# EAGLE design SA_Shield (EAGLE 9.6.2)
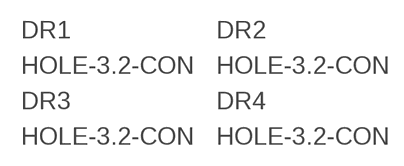
[diagram p0: schematic, sheet 1]

## Parts
DR1  HOLE-3.2-CON  [HOLE_3.2_CON]
DR2  HOLE-3.2-CON  [HOLE_3.2_CON]
DR3  HOLE-3.2-CON  [HOLE_3.2_CON]
DR4  HOLE-3.2-CON  [HOLE_3.2_CON]

## Library data of the parts
DR1-DR4 = my_connector:HOLE-3.2

## Board
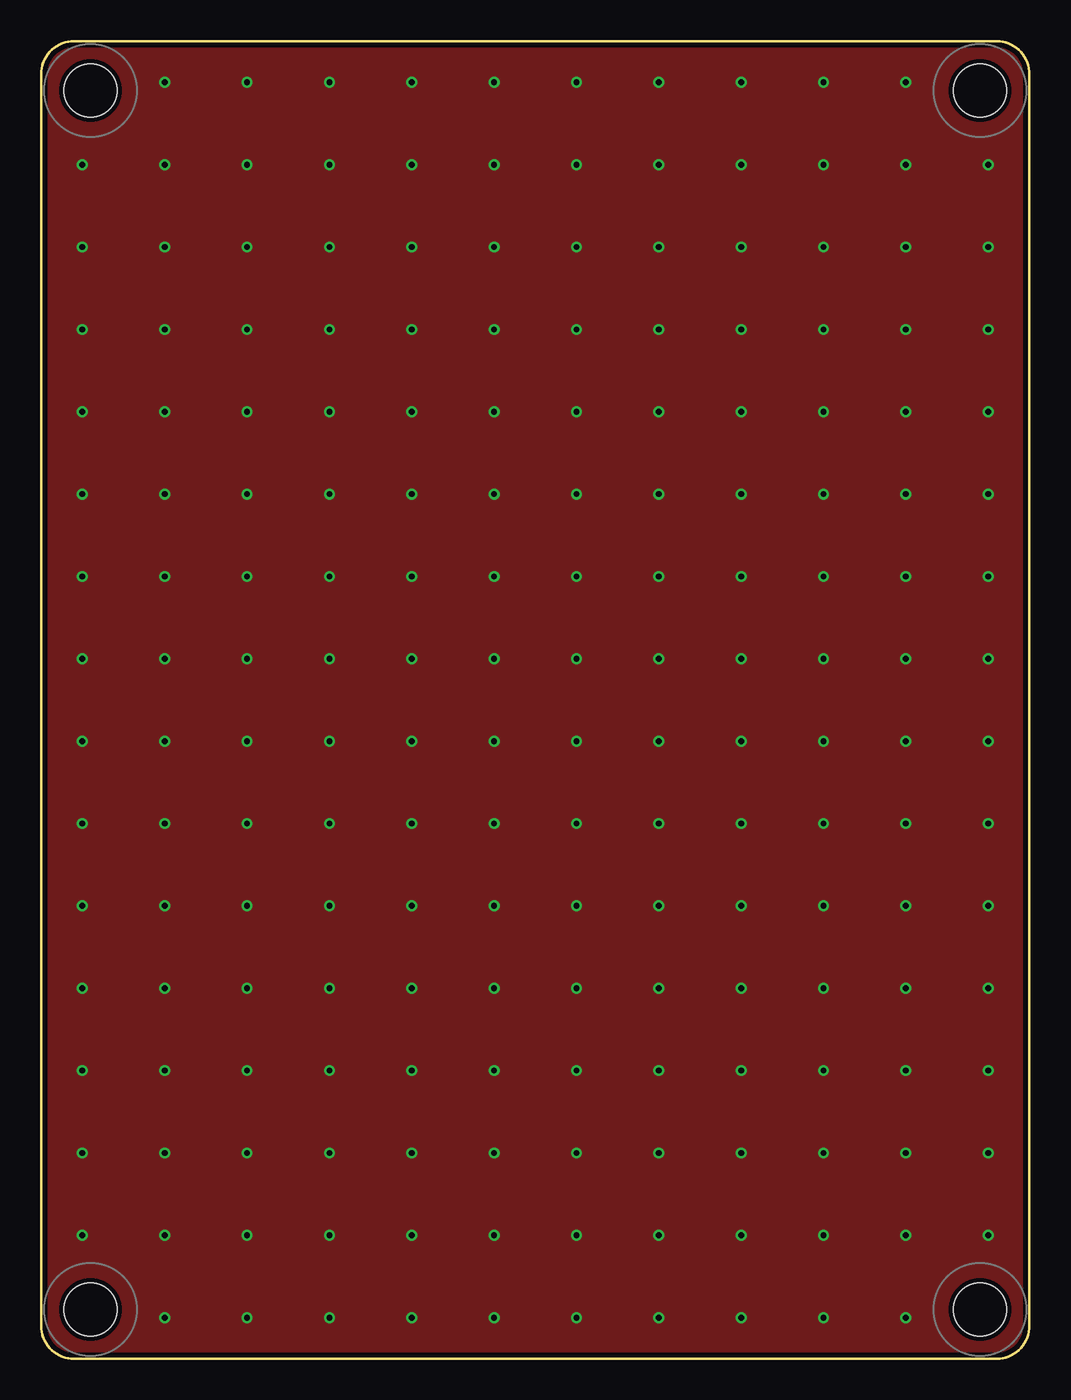
[diagram p1: board, top side]
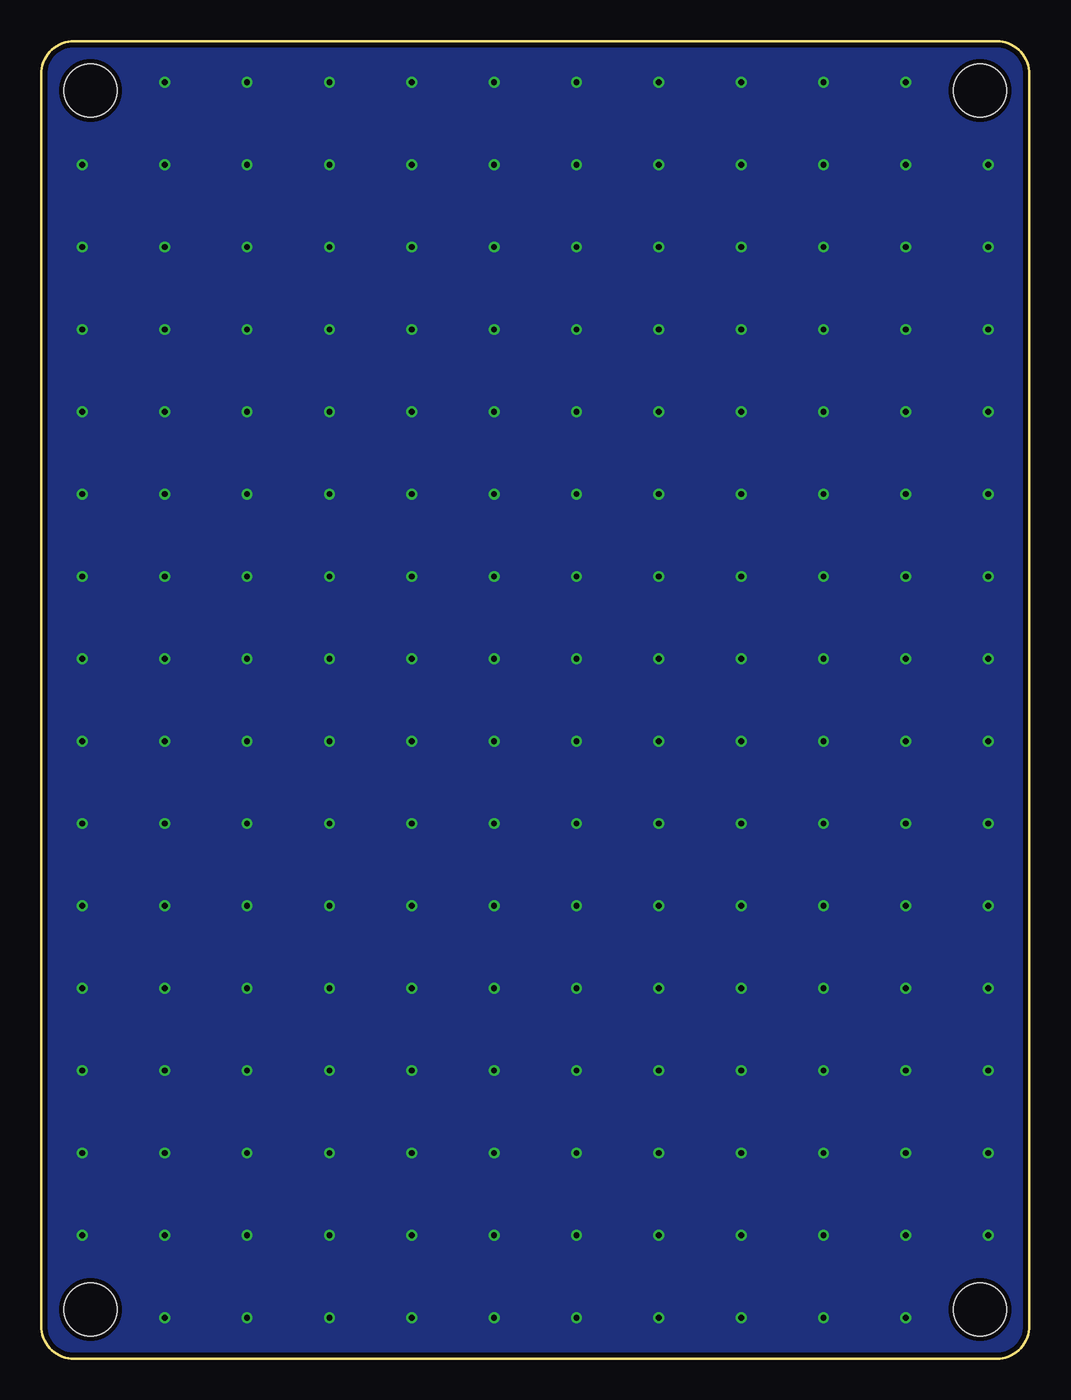
[diagram p2: board, bottom side, seen from below]

Size 60 x 80 mm. Coordinates in mm from the lower left corner, seen from the top.
Outline: 2,0 58,0 arc90 60,2 60,78 arc90 58,80 2,80 arc90 0,78 0,2 arc90 2,0
Copper layers (1*16): Top 0.035mm / dielectric 1.5mm / Bottom 0.035mm
Design rules "SeeedStudio_2layer_DRU_20140221": minimum track width 6mil, minimum drill 0.3mm, track to track 8mil, track to pad 8mil, pad to pad 8mil, via to via 12mil, smd to smd 0mil, copper to edge 0.3mm, drill to drill 10mil, minimum pad ring 0.15mm, minimum via ring 6mil, stop-mask expansion 2mil, vias tented up to drill 1mm, thermal gap 10mil

### Footprints (pad centres in the part's own frame; a part is rotated, then mirrored left to right if it is on the bottom)
HOLE_3.2_CON = hole 3.2: 0,0

### Placement (x,y rotation side)
DR1  3,3 0 top
DR2  3,77 0 top
DR3  57,3 0 top
DR4  57,77 0 top

### Tracks (layer width: path | path; a pad name or v marks a point on that pad's centre or on a via)
GND  (via drill 0.35)
  other vias: 7.5,2.5 12.5,2.5 17.5,2.5 22.5,2.5 27.5,2.5 32.5,2.5 37.5,2.5 42.5,2.5 47.5,2.5 2.5,7.5 7.5,7.5 12.5,7.5 17.5,7.5 22.5,7.5 27.5,7.5 32.5,7.5 37.5,7.5 42.5,7.5 47.5,7.5 52.5,7.5 57.5,7.5 52.5,2.5 2.5,12.5 7.5,12.5 12.5,12.5 17.5,12.5 22.5,12.5 27.5,12.5 32.5,12.5 37.5,12.5 42.5,12.5 47.5,12.5 52.5,12.5 57.5,12.5 2.5,27.5 7.5,27.5 12.5,27.5 17.5,27.5 22.5,27.5 27.5,27.5 32.5,27.5 37.5,27.5 42.5,27.5 47.5,27.5 52.5,27.5 57.5,27.5 2.5,32.5 7.5,32.5 12.5,32.5 17.5,32.5 22.5,32.5 27.5,32.5 32.5,32.5 37.5,32.5 42.5,32.5 47.5,32.5 52.5,32.5 57.5,32.5 2.5,17.5 7.5,17.5 12.5,17.5 17.5,17.5 22.5,17.5 27.5,17.5 32.5,17.5 37.5,17.5 42.5,17.5 47.5,17.5 52.5,17.5 57.5,17.5 2.5,22.5 7.5,22.5 12.5,22.5 17.5,22.5 22.5,22.5 27.5,22.5 32.5,22.5 37.5,22.5 42.5,22.5 47.5,22.5 52.5,22.5 57.5,22.5 2.5,47.5 7.5,47.5 12.5,47.5 17.5,47.5 22.5,47.5 27.5,47.5 32.5,47.5 37.5,47.5 42.5,47.5 47.5,47.5 52.5,47.5 57.5,47.5 2.5,52.5 7.5,52.5 12.5,52.5 17.5,52.5 22.5,52.5 27.5,52.5 32.5,52.5 37.5,52.5 42.5,52.5 47.5,52.5 52.5,52.5 57.5,52.5 2.5,37.5 7.5,37.5 12.5,37.5 17.5,37.5 22.5,37.5 27.5,37.5 32.5,37.5 37.5,37.5 42.5,37.5 47.5,37.5 52.5,37.5 57.5,37.5 2.5,42.5 7.5,42.5 12.5,42.5 17.5,42.5 22.5,42.5 27.5,42.5 32.5,42.5 37.5,42.5 42.5,42.5 47.5,42.5 52.5,42.5 57.5,42.5 2.5,72.5 7.5,72.5 12.5,72.5 17.5,72.5 22.5,72.5 27.5,72.5 32.5,72.5 37.5,72.5 42.5,72.5 47.5,72.5 52.5,72.5 57.5,72.5 7.5,77.5 12.5,77.5 17.5,77.5 22.5,77.5 27.5,77.5 32.5,77.5 37.5,77.5 42.5,77.5 47.5,77.5 52.5,77.5 2.5,57.5 7.5,57.5 12.5,57.5 17.5,57.5 22.5,57.5 27.5,57.5 32.5,57.5 37.5,57.5 42.5,57.5 47.5,57.5 52.5,57.5 57.5,57.5 2.5,62.5 7.5,62.5 12.5,62.5 17.5,62.5 22.5,62.5 27.5,62.5 32.5,62.5 37.5,62.5 42.5,62.5 47.5,62.5 52.5,62.5 57.5,62.5 2.5,67.5 7.5,67.5 12.5,67.5 17.5,67.5 22.5,67.5 27.5,67.5 32.5,67.5 37.5,67.5 42.5,67.5 47.5,67.5 52.5,67.5 57.5,67.5
  pour Top (isolate 0.254, rank 2, no thermals): 0,0 0,80 60,80 60,0
  pour Bottom (isolate 0.254, no thermals): 0,0 60,0 60,80 0,80